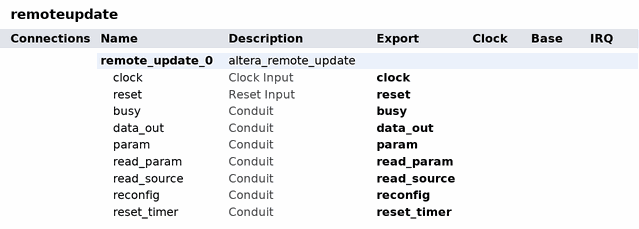
[diagram p0: system contents]
# Platform Designer (Qsys) system remoteupdate, Cyclone IV E EP4CE30F23C6
# Parameters at their usual value, and those the tool derives, are not listed.
package require -exact qsys 23.1
create_system remoteupdate
set_project_property DEVICE_FAMILY {Cyclone IV E}
set_project_property DEVICE EP4CE30F23C6

add_instance remote_update_0 altera_remote_update 23.1
set_instance_property remote_update_0 AUTO_EXPORT true
set_instance_parameter_value remote_update_0 CBX_AUTO_BLACKBOX ALL
set_instance_parameter_value remote_update_0 DEVICE EP4CE30F23C6
set_instance_parameter_value remote_update_0 GUI_config_device EPCS16
set_instance_parameter_value remote_update_0 check_app_pof false
set_instance_parameter_value remote_update_0 check_avalon_interface false
set_instance_parameter_value remote_update_0 m_support_write_config_check false
set_instance_parameter_value remote_update_0 operation_mode REMOTE

# exported interfaces
add_interface busy conduit end
set_interface_property busy EXPORT_OF remote_update_0.busy
add_interface clock clock sink
set_interface_property clock EXPORT_OF remote_update_0.clock
add_interface data_out conduit end
set_interface_property data_out EXPORT_OF remote_update_0.data_out
add_interface param conduit end
set_interface_property param EXPORT_OF remote_update_0.param
add_interface read_param conduit end
set_interface_property read_param EXPORT_OF remote_update_0.read_param
add_interface read_source conduit end
set_interface_property read_source EXPORT_OF remote_update_0.read_source
add_interface reconfig conduit end
set_interface_property reconfig EXPORT_OF remote_update_0.reconfig
add_interface reset reset sink
set_interface_property reset EXPORT_OF remote_update_0.reset
add_interface reset_timer conduit end
set_interface_property reset_timer EXPORT_OF remote_update_0.reset_timer

set_interconnect_requirement {$system} qsys_mm.clockCrossingAdapter HANDSHAKE
set_interconnect_requirement {$system} qsys_mm.enableEccProtection FALSE
set_interconnect_requirement {$system} qsys_mm.insertDefaultSlave FALSE
set_interconnect_requirement {$system} qsys_mm.maxAdditionalLatency 1

save_system remoteupdate.qsys
